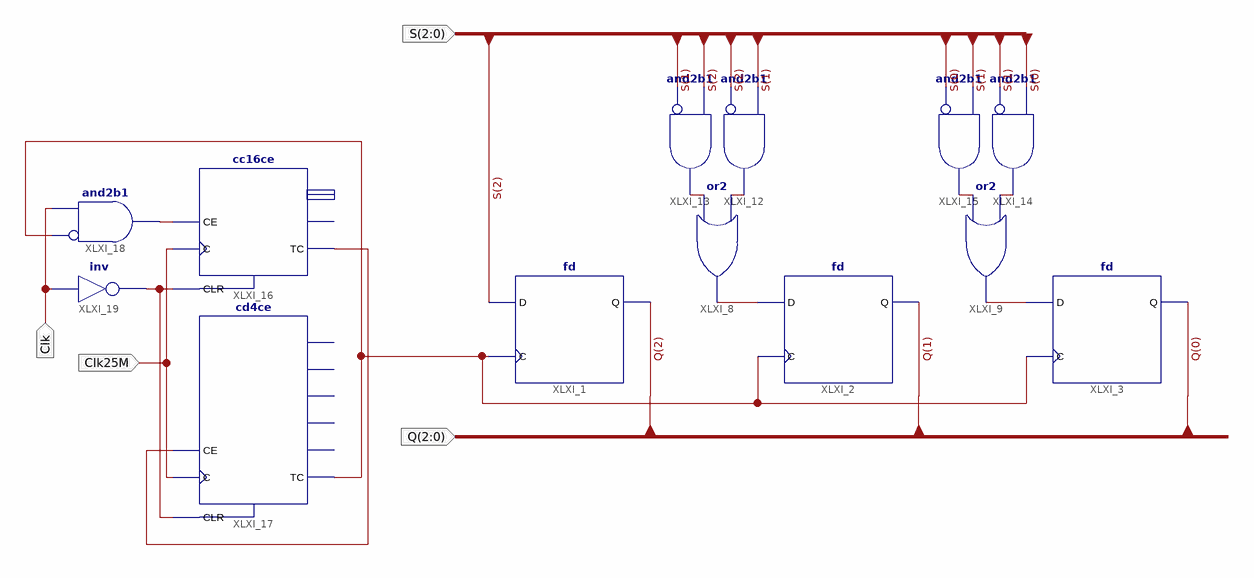
[diagram p0: schematic sheet 1]
// Xilinx ISE schematic sch.sch (spartan3e) as structural Verilog: 13 symbols, 4 ports
module sch (
  input  [2:0] Q,
  input  [2:0] S,
  input  Clk,
  input  Clk25M
);

  wire XLXN_15, XLXN_17, XLXN_20, XLXN_21, XLXN_22, XLXN_23, XLXN_34, XLXN_35, XLXN_37, XLXN_38;

  fd XLXI_1 (.C(XLXN_35), .D(S[2]), .Q(Q[2]));
  fd XLXI_2 (.C(XLXN_35), .D(XLXN_15), .Q(Q[1]));
  fd XLXI_3 (.C(XLXN_35), .D(XLXN_17), .Q(Q[0]));
  or XLXI_8 (XLXN_15, XLXN_20, XLXN_21);
  or XLXI_9 (XLXN_17, XLXN_22, XLXN_23);
  and XLXI_12 (XLXN_21, ~S[2], S[1]);  // and2b1
  and XLXI_13 (XLXN_20, ~S[1], S[2]);  // and2b1
  and XLXI_14 (XLXN_23, ~S[1], S[0]);  // and2b1
  and XLXI_15 (XLXN_22, ~S[0], S[1]);  // and2b1
  cc16ce XLXI_16 (.C(Clk25M), .CE(XLXN_34), .CLR(XLXN_37), .TC(XLXN_38));  // open: CEO, Q
  cd4ce XLXI_17 (.C(Clk25M), .CE(XLXN_38), .CLR(XLXN_37), .TC(XLXN_35));  // open: CEO, Q0, Q1, Q2, Q3
  and XLXI_18 (XLXN_34, ~XLXN_35, Clk);  // and2b1
  not XLXI_19 (XLXN_37, Clk);
endmodule
